# Altium project toilet-sensing-v0.1.PrjPcb
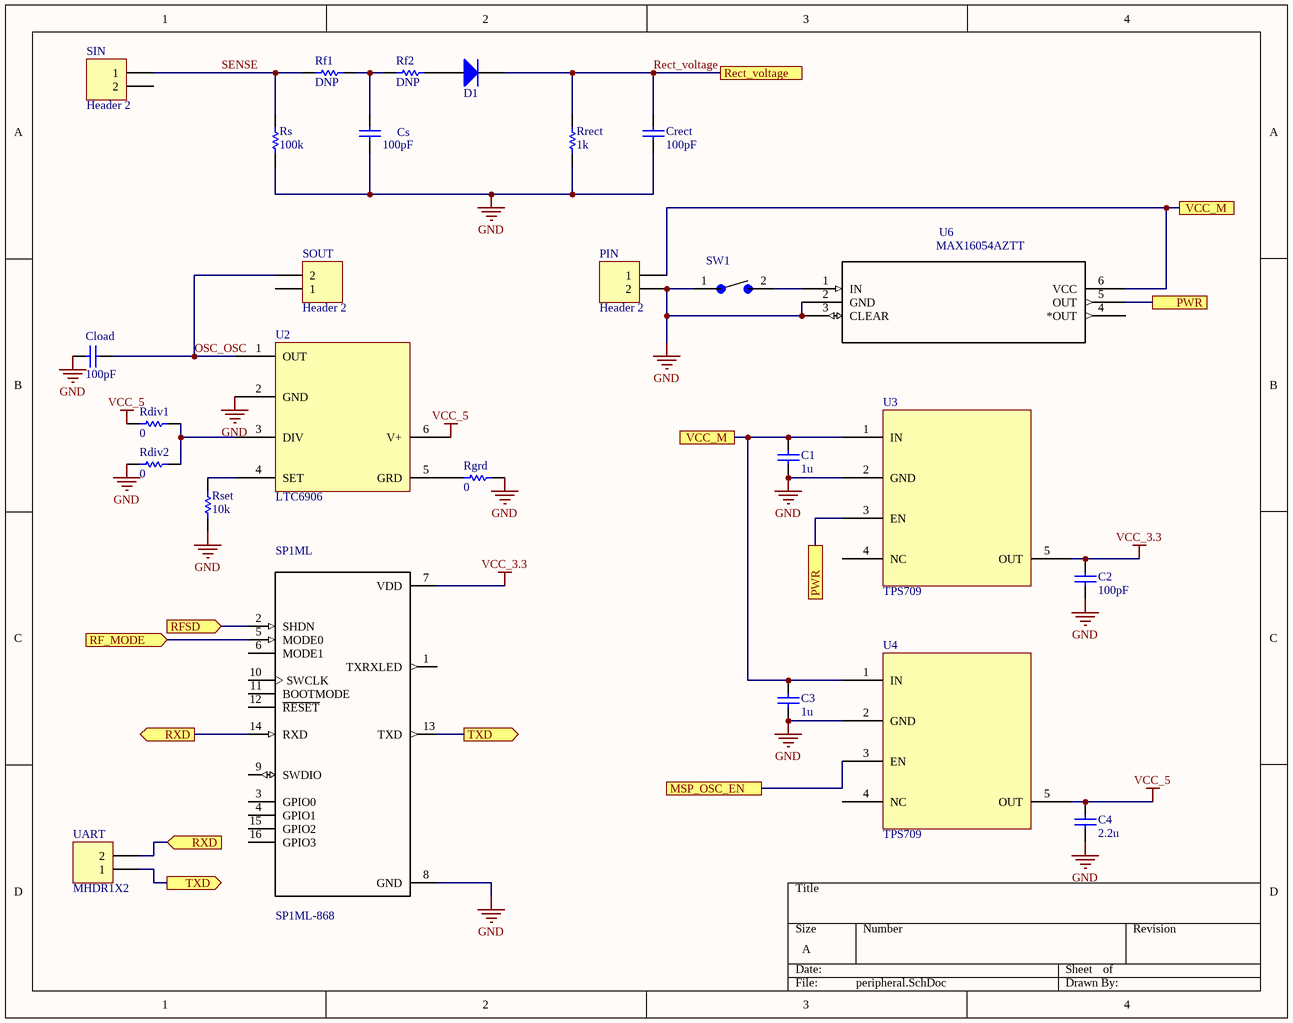
[diagram p0: peripheral.SchDoc]
2 sheets, 40 parts. Net scope: flat (ports and power ports of the same name join across sheets).
Board file: FlowSense-TX.PcbDoc
Sheets:
  peripheral.SchDoc
  MSP430.SchDoc

## Sheet peripheral.SchDoc
size A

### Parts
C1  value 1u  [0402-W]  (hidden comment: Cap)
C2  value 100pF  [0402-W]  (hidden comment: Cap)
C3  value 1u  [0402-W]  (hidden comment: Cap)
C4  value 2.2u  [0402-W]  (hidden comment: Cap)
Cload  value 100pF  [0402-W]  (hidden comment: Cap)
Crect  value 100pF  [0402-W]  (hidden comment: Cap)
Cs  value 100pF  [0402-W]  (hidden comment: Cap)
D1  Diode  [DIODE - SOD123]  (value not drawn)
PIN  Header 2  [HDR1X2]
Rdiv1  value 0  [0402]  (hidden comment: Res)
Rdiv2  value 0  [0402]  (hidden comment: Res)
Rf1  value DNP  [0402]  (hidden comment: Res)
Rf2  value DNP  [0402]  (hidden comment: Res)
Rgrd  value 0  [0402]  (hidden comment: Res)
Rrect  value 1k  [0402]  (hidden comment: Res)
Rs  value 100k  [0402]  (hidden comment: Res)
Rset  value 10k  [0402]  (hidden comment: Res)
SIN  Header 2  [HDR1X2]
SOUT  Header 2  [HDR1X2]
SP1ML  SP1ML-868  [STM_SP1ML-868]
SW1  FSMSM _1437566-3_  [TE_FSMSM]  (value not drawn)
U2  LTC6906  [6-Lead Plastic TSOT-23]
U3  TPS709  [SOT95P280X145-5N]
U4  TPS709  [SOT95P280X145-5N]
U6  MAX16054AZTT  [21-0114C]
UART  MHDR1X2  [MHDR1X2]

### Ports
MSP_OSC_EN, PWR, Rect_voltage, RF_MODE (in), RFSD (in), RXD (in), RXD (out), TXD (out), VCC_M

### Nets
GND: C1.1 C2.1 C3.1 C4.1 Cload.1 Crect.1 Cs.1 PIN.2 Rdiv2.1 Rgrd.2 Rrect.1 Rs.1 Rset.1 SP1ML.8(GND) SW1.1 U2.2(GND) U3.2(GND) U4.2(GND) U6.2(GND) U6.3(CLEAR)
VCC_3.3: C2.2 SP1ML.7(VDD) U3.5(OUT)
VCC_5: C4.2 Rdiv1.1 U2.6(V+) U4.5(OUT)
OSC_OSC: Cload.2 SOUT.2 U2.1(OUT)
Rect_voltage: Crect.2 D1.2(C) Rrect.2 ; port Rect_voltage
SENSE: Rf1.1 Rs.2 SIN.1
NetC1_2: C1.2 C3.2 PIN.1 U3.1(IN) U4.1(IN) U6.6(VCC) ; port VCC_M
NetCs_2: Cs.2 Rf1.2 Rf2.1
NetD1_1: D1.1(A) Rf2.2
NetRdiv1_2: Rdiv1.2 Rdiv2.2 U2.3(DIV)
NetRgrd_1: Rgrd.1 U2.5(GRD)
NetRset_2: Rset.2 U2.4(SET)
NetSP1ML_2: SP1ML.2(SHDN) ; port RFSD
NetSP1ML_5: SP1ML.5(MODE0) ; port RF_MODE
NetSP1ML_13: SP1ML.13(TXD) UART.1 ; port TXD
NetSP1ML_14: SP1ML.14(RXD) UART.2 ; port RXD
NetSW1_2: SW1.2 U6.1(IN)
NetU1_16: U4.3(EN) ; port MSP_OSC_EN
NetU3_3: U3.3(EN) U6.5(OUT) ; port PWR

Not connected (* = marked no-connect by the designer): SIN 2; SOUT 1; SP1ML 1(TXRXLED) 3(GPIO0) 4(GPIO1) 6(MODE1) 9(SWDIO) 10(SWCLK) 11(BOOTMODE) 12(~{RESET}) 15(GPIO2) 16(GPIO3); U3 4(NC); U4 4(NC); U6 4(*OUT)

### Library data of the parts
C1-C4 Cload Crect Cs = Cap: Ceramic Capacitor (Surface Mount); Manufacturer: Generic Ceramic Chip Cap (TBD); Digi-Key Part Number: *; Manufacturer Part Number: *; Note: *; Rating: *
D1 = Diode: General Purpose Diode; Manufacturer: *; Manufacturer Part Number: *; Digi-Key Part Number: *; Value: *; Rating: *; Note: *
PIN SIN SOUT = Header 2: Header, 2-Pin; LatestRevisionDate: 17-Jul-2002; LatestRevisionNote: Re-released for DXP Platform.; Publisher: Altium Limited
Rdiv1 Rdiv2 Rf1 Rf2 Rgrd Rrect Rs Rset = Res: Chip Resistor (Surface Mount); Manufacturer: Generic Chip Res (TBD); Manufacturer Part Number: *; Digi-Key Part Number: *; Rating: *
SP1ML = SP1ML-868: RF TXRX MODULE ISM<1GHZ CHIP ANT; MF: STMicroelectronics; Availability: Good; MP: SP1ML-868; Price: 16.88 USD; Package: SMD-16 STMicroelectronics; Value: *
SW1 = FSMSM: FSMSM=3.5X6 SMT TACT; MF: TE Connectivity; Price: None; SnapEDA_Link: https://www.snapeda.com/parts/FSMSM/TE%20Connectivity%20/%20DEUTSCH/view-part/?ref=snap; MP: FSMSM; Availability: Unavailable; Package: None; Value: *
U2 = LTC6906: LP Oscilloter
U3 U4 = TPS709: Ultra low power Voltage Regulator
U6 = MAX16054AZTT: On/Off Controller With Debounce And +/-1; MF: Maxim Integrated; MP: MAX16054AZT+; SnapEDA_Link: https://www.snapeda.com/parts/MAX16054AZT%2B/Maxim%20Integrated/view-part/?ref=snap; Package: TSOT-23 Maxim Integrated; Price: 2.94 USD; Availability: Unavailable; Value: *
UART = MHDR1X2: Header, 2-Pin; LatestRevisionDate: 17-Jul-2002; LatestRevisionNote: Re-released for DXP Platform.; Publisher: Altium Limited

## Sheet MSP430.SchDoc
size A
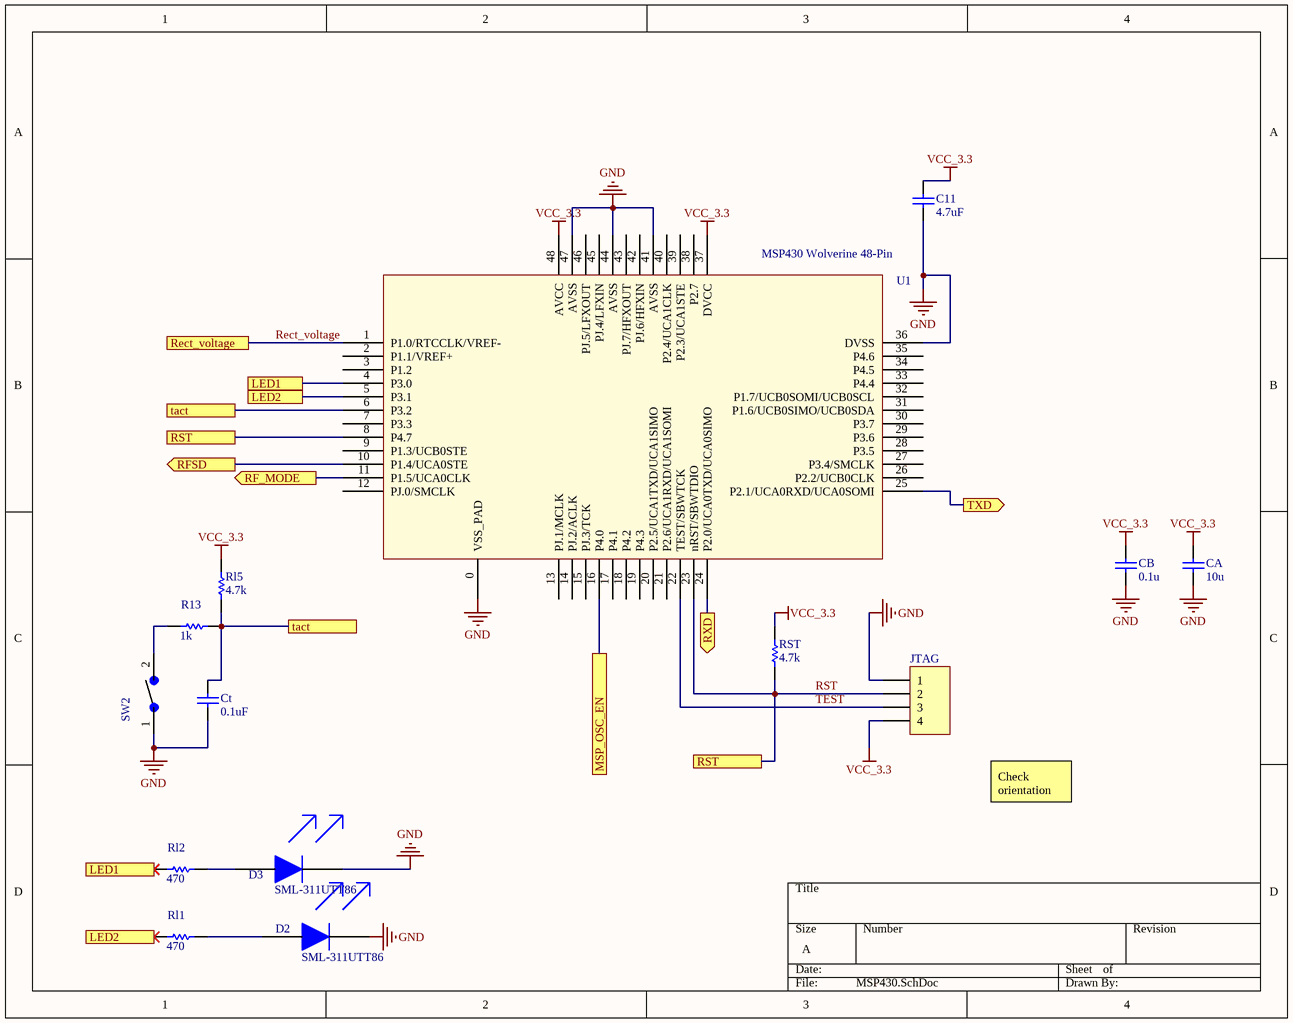
[diagram p1: MSP430.SchDoc]

### Parts
C11  value 4.7uF  [0402-W]  (hidden comment: Cap)
CA  value 10u  [0402-W]  (hidden comment: Cap)
CB  value 0.1u  [0402-W]  (hidden comment: Cap)
Ct  value 0.1uF  [0402-W]  (hidden comment: Cap)
D2  SML-311UTT86  [0603]
D3  SML-311UTT86  [0603]
JTAG  MHDR1X4  [MHDR1X4]  (value not drawn)
R13  value 1k  [0402]  (hidden comment: Res)
Rl1  value 470  [0402]  (hidden comment: Res)
Rl2  value 470  [0402]  (hidden comment: Res)
Rl5  value 4.7k  [0402]  (hidden comment: Res)
RST  RST: 4.7k  [0402]  (hidden comment: Res)
SW2  FSMSM _1437566-3_  [TE_FSMSM]  (value not drawn)
U1  MSP430 Wolverine 48-Pin  [MSP_QFN48_RGZ_PAD0]

### Ports
LED1, LED2, MSP_OSC_EN, Rect_voltage, RF_MODE (out), RFSD (out), RST, RXD (out), tact, TXD (out)

### Nets
GND: C11.1 CA.1 CB.1 Ct.1 D2.2 D3.2 JTAG.1 SW2.1 U1.0(VSS_PAD) U1.36(DVSS) U1.41(AVSS) U1.44(AVSS) U1.47(AVSS)
VCC_3.3: C11.2 CA.2 CB.2 JTAG.4 Rl5.1 RST.2 U1.37(DVCC) U1.48(AVCC)
Rect_voltage: U1.1(P1.0/RTCCLK/VREF-) ; port Rect_voltage
RST: JTAG.2 RST.1 U1.8(P4.7) U1.23(nRST/SBWTDIO) ; port RST
TEST: JTAG.3 U1.22(TEST/SBWTCK)
NetCt_2: Ct.2 R13.1 Rl5.2 U1.6(P3.2) ; port tact
NetD2_1: D2.1 Rl1.1
NetD3_1: D3.1 Rl2.1
NetR13_2: R13.2 SW2.2
NetRl1_2: Rl1.2 U1.5(P3.1) ; port LED2
NetRl2_2: Rl2.2 U1.4(P3.0) ; port LED1
NetSP1ML_2: U1.10(P1.4/UCA0STE) ; port RFSD
NetSP1ML_5: U1.11(P1.5/UCA0CLK) ; port RF_MODE
NetSP1ML_13: U1.25(P2.1/UCA0RXD/UCA0SOMI) ; port TXD
NetSP1ML_14: U1.24(P2.0/UCA0TXD/UCA0SIMO) ; port RXD
NetU1_16: U1.16(P4.0) ; port MSP_OSC_EN

Not connected (* = marked no-connect by the designer): U1 2(P1.1/VREF+) 3(P1.2) 7(P3.3) 9(P1.3/UCB0STE) 12(PJ.0/SMCLK) 13(PJ.1/MCLK) 14(PJ.2/ACLK) 15(PJ.3/TCK) 17(P4.1) 18(P4.2) 19(P4.3) 20(P2.5/UCA1TXD/UCA1SIMO) 21(P2.6/UCA1RXD/UCA1SOMI) 26(P2.2/UCB0CLK) 27(P3.4/SMCLK) 28(P3.5) 29(P3.6) 30(P3.7) 31(P1.6/UCB0SIMO/UCB0SDA) 32(P1.7/UCB0SOMI/UCB0SCL) 33(P4.4) 34(P4.5) 35(P4.6) 38(P2.7) 39(P2.3/UCA1STE) 40(P2.4/UCA1CLK) 42(PJ.6/HFXIN) 43(PJ.7/HFXOUT) 45(PJ.4/LFXIN) 46(PJ.5/LFXOUT)

### Notes on the sheet
- Check orientation

### Library data of the parts
C11 CA CB Ct = Cap: as C1 on sheet peripheral; Digi-Key Part Number: *; Manufacturer Part Number: *; Note: *; Rating: *
D2 D3 = SML-311UTT86: LED 630NM RED WTR CLR 0603 SMD
JTAG = MHDR1X4: Header, 4-Pin; LatestRevisionDate: 17-Jul-2002; LatestRevisionNote: Re-released for DXP Platform.; Publisher: Altium Limited
R13 Rl1 Rl2 Rl5 RST = Res: as Rdiv1 on sheet peripheral; Manufacturer Part Number: *; Digi-Key Part Number: *; Rating: *
SW2 = FSMSM: as SW1 on sheet peripheral; Price: None; SnapEDA_Link: https://www.snapeda.com/parts/FSMSM/TE%20Connectivity%20/%20DEUTSCH/view-part/?ref=snap; MP: FSMSM; Availability: Unavailable; Package: None; Value: *
U1 = MSP430FR596X_586X_RGZ: 16-bit FRAM MCU

## Nets that join several sheets
GND: peripheral (20 pins), MSP430 (13 pins)
VCC_3.3: peripheral (C2.2 SP1ML.7 U3.5), MSP430 (8 pins)
NetSP1ML_2: peripheral (SP1ML.2), MSP430 (U1.10)
NetSP1ML_5: peripheral (SP1ML.5), MSP430 (U1.11)
NetSP1ML_13: peripheral (SP1ML.13 UART.1), MSP430 (U1.25)
NetSP1ML_14: peripheral (SP1ML.14 UART.2), MSP430 (U1.24)
NetU1_16: peripheral (U4.3), MSP430 (U1.16)
Rect_voltage: peripheral (Crect.2 D1.2 Rrect.2), MSP430 (U1.1)